# Altium schematic sheet P2_CCD_CAM_BOARD_POWER.SchDoc (part 3 of 3)
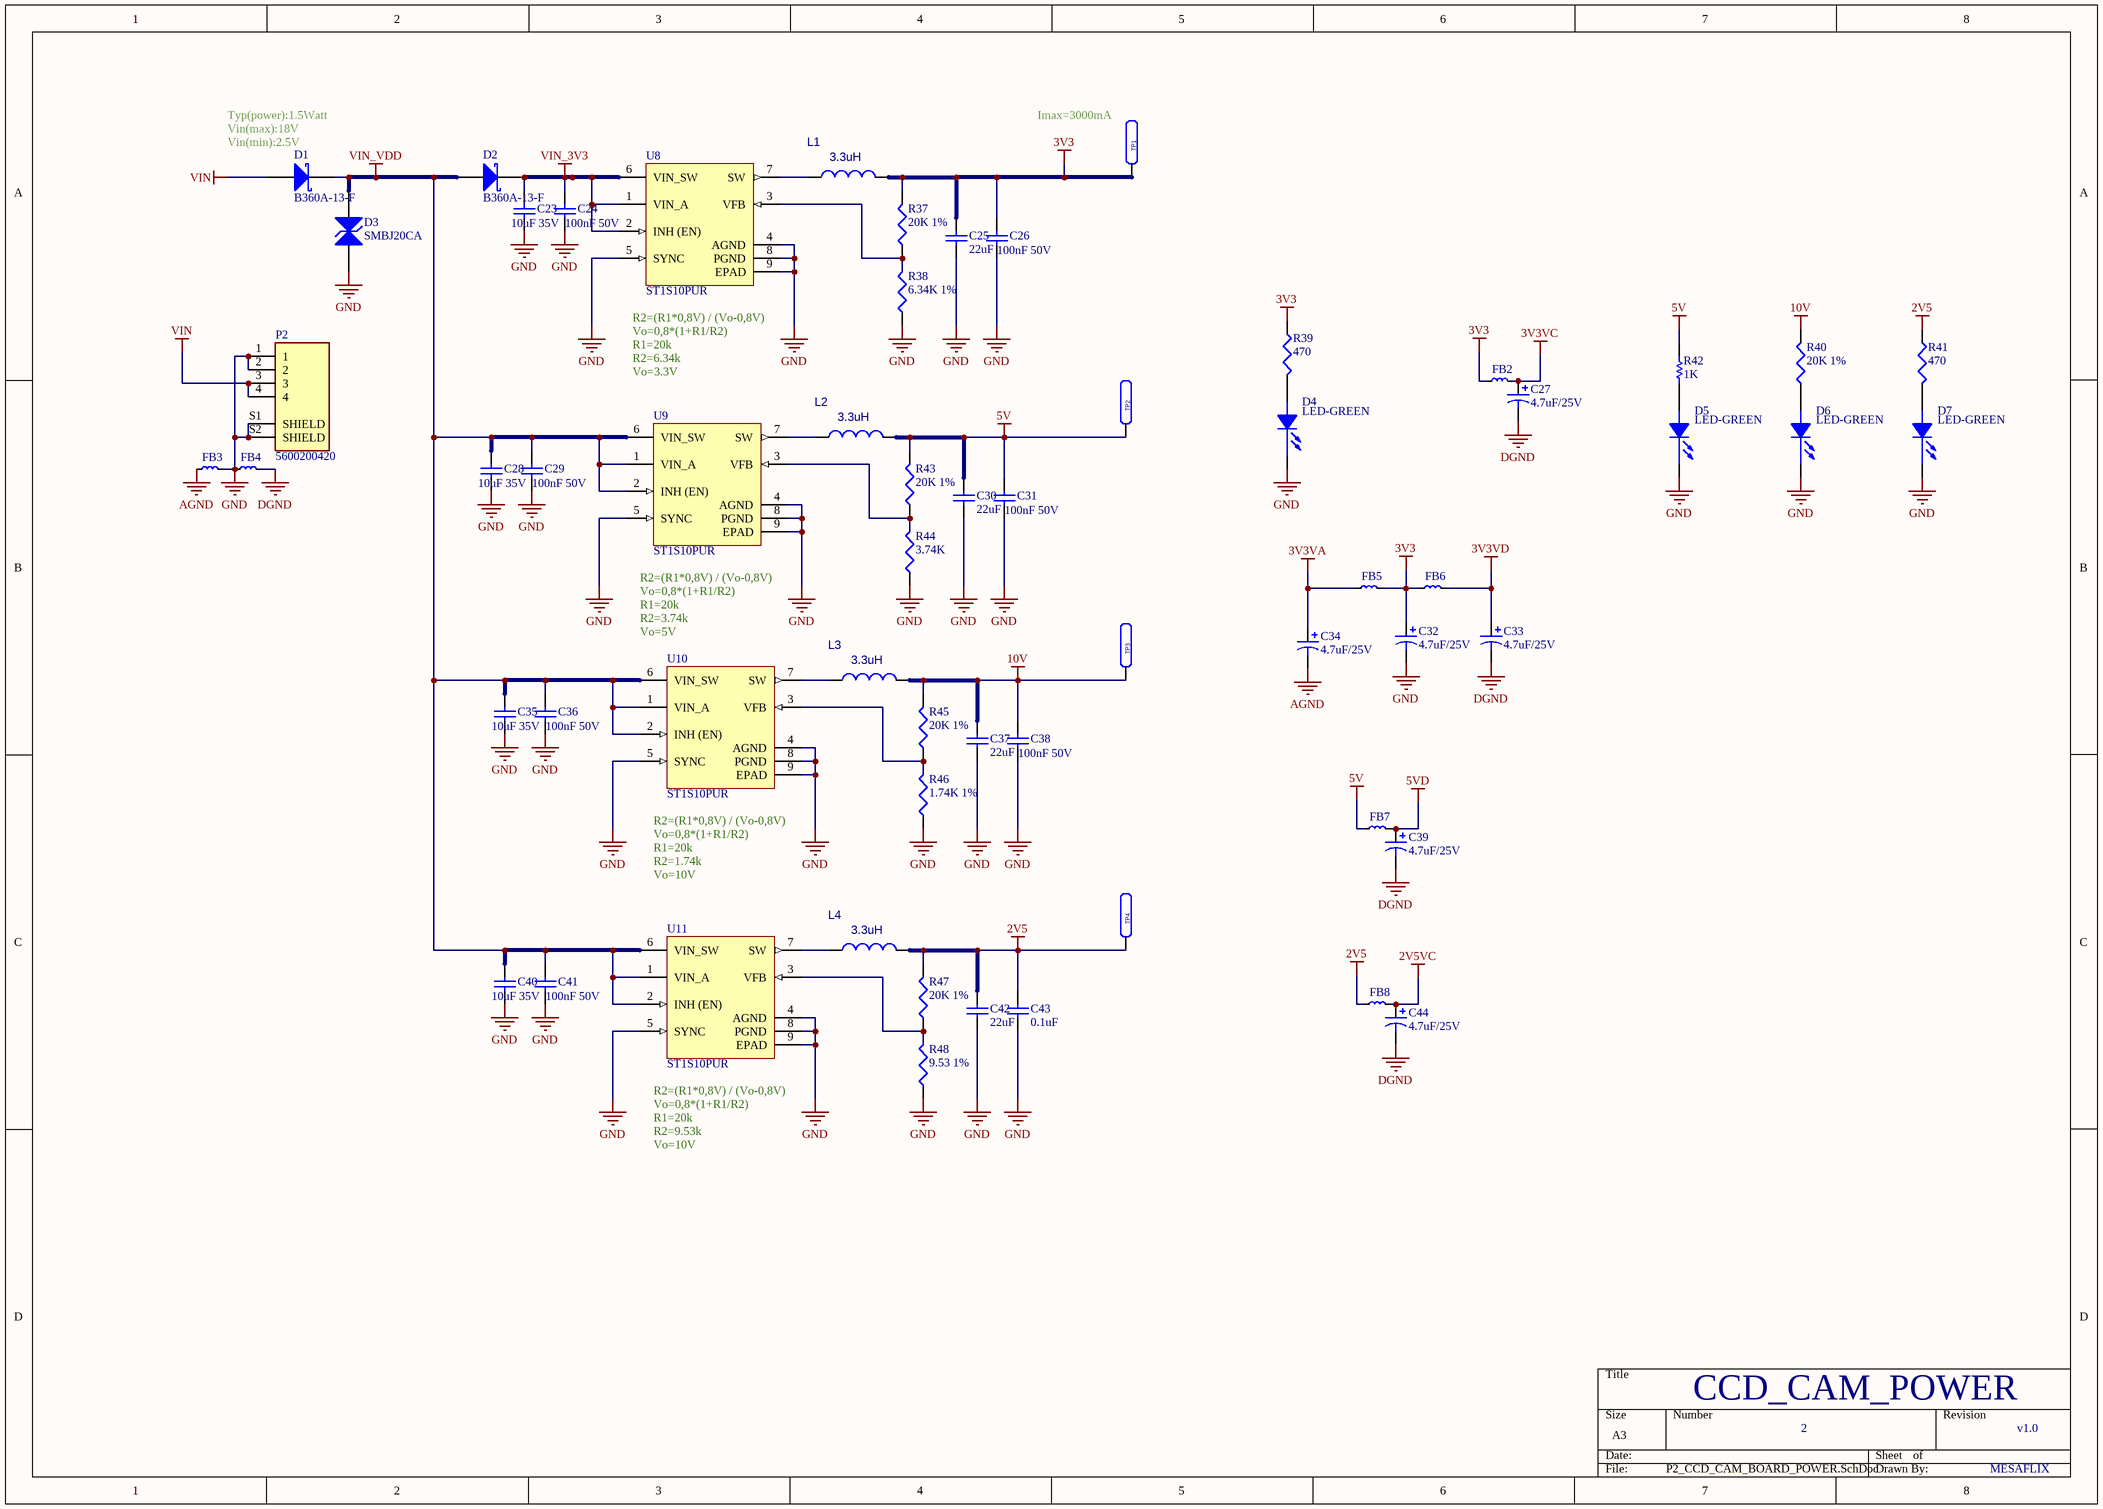
[diagram p2: P2_CCD_CAM_BOARD_POWER.SchDoc]

## Library data of the parts (continued)
R46 = Res3: RES SMD 1.74K OHM 1% 1/16W 0402; MPN: RC0402FR-071K74L; ComponentLink1URL: https://datasheet.ciiva.com/11819/0900766b80c66297-11819477.pdf?src-supplier=RSComponents; ComponentLink1Description: https://datasheet.ciiva.com/11819/0900766b80c66297-11819477.pdf?src-supplier=RSComponents; ComponentLink2URL: https://datasheet.ciiva.com/12666/pyu-rc0402-51-rohs-l-6-r-12666741.pdf?src-supplier=Mouser; ComponentLink2Description: https://datasheet.ciiva.com/12666/pyu-rc0402-51-rohs-l-6-r-12666741.pdf?src-supplier=Mouser; ComponentLink3URL: https://datasheet.ciiva.com/17063/pyu-rc0402-51-rohs-l-6-r-17063193.pdf?src-supplier=Future+Electronics; ComponentLink3Description: https://datasheet.ciiva.com/17063/pyu-rc0402-51-rohs-l-6-r-17063193.pdf?src-supplier=Future+Electronics; ComponentLink4URL: https://datasheet.ciiva.com/22747/1018594-22747513.pdf?src-supplier=Element14; ComponentLink4Description: https://datasheet.ciiva.com/22747/1018594-22747513.pdf?src-supplier=Element14; ComponentLink5URL: https://datasheet.ciiva.com/7849/1018594-7849869.pdf?src-supplier=Element14; ComponentLink5Description: https://datasheet.ciiva.com/7849/1018594-7849869.pdf?src-supplier=Element14; ComponentLink6URL: https://datasheet.ciiva.com/7983/1018594-7983502.pdf?src-supplier=Element14; ComponentLink6Description: https://datasheet.ciiva.com/7983/1018594-7983502.pdf?src-supplier=Element14; ComponentLink7URL: https://datasheet.ciiva.com/7849/1018594-7849871.pdf?src-supplier=Element14; ComponentLink7Description: https://datasheet.ciiva.com/7849/1018594-7849871.pdf?src-supplier=Element14; ComponentLink8URL: https://datasheet.ciiva.com/2553/pyu-r-int-thick-7-2553200.pdf?src-supplier=Digi-Key; ComponentLink8Description: https://datasheet.ciiva.com/2553/pyu-r-int-thick-7-2553200.pdf?src-supplier=Digi-Key; ComponentLink9URL: https://datasheet.ciiva.com/7983/1018594-7983501.pdf?src-supplier=Element14; ComponentLink9Description: https://datasheet.ciiva.com/7983/1018594-7983501.pdf?src-supplier=Element14; ComponentLink10URL: https://datasheet.ciiva.com/2553/pyu-r-int-thick-7-2553201.pdf?src-supplier=Digi-Key; ComponentLink10Description: https://datasheet.ciiva.com/2553/pyu-r-int-thick-7-2553201.pdf?src-supplier=Digi-Key; ComponentLink11URL: https://datasheet.ciiva.com/2553/pyu-r-int-thick-7-2553202.pdf?src-supplier=Digi-Key; ComponentLink11Description: https://datasheet.ciiva.com/2553/pyu-r-int-thick-7-2553202.pdf?src-supplier=Digi-Key; ComponentLink12URL: https://datasheet.ciiva.com/15189/getdatasheetpartid-251817-15189388.pdf?src-supplier=Verical; ComponentLink12Description: https://datasheet.ciiva.com/15189/getdatasheetpartid-251817-15189388.pdf?src-supplier=Verical; ComponentLink13URL: https://datasheet.ciiva.com/11808/0900766b80c66297-11808454.pdf?src-supplier=RSComponents; ComponentLink13Description: https://datasheet.ciiva.com/11808/0900766b80c66297-11808454.pdf?src-supplier=RSComponents; ComponentLink14URL: https://datasheet.ciiva.com/2453/pyu-r-int-thick-7-2453494.pdf?src-supplier=Digi-Key; ComponentLink14Description: https://datasheet.ciiva.com/2453/pyu-r-int-thick-7-2453494.pdf?src-supplier=Digi-Key; ComponentLink15URL: https://datasheet.ciiva.com/2453/pyu-r-int-thick-7-2453495.pdf?src-supplier=Digi-Key; ComponentLink15Description: https://datasheet.ciiva.com/2453/pyu-r-int-thick-7-2453495.pdf?src-supplier=Digi-Key; ComponentLink16URL: https://datasheet.ciiva.com/7983/1018594-7983511.pdf?src-supplier=Element14; ComponentLink16Description: https://datasheet.ciiva.com/7983/1018594-7983511.pdf?src-supplier=Element14; ComponentLink17URL: https://datasheet.ciiva.com/12558/pyu-rc0402-51-rohs-l-6-r-8721-12558796.pdf?src-supplier=Mouser; ComponentLink17Description: https://datasheet.ciiva.com/12558/pyu-rc0402-51-rohs-l-6-r-8721-12558796.pdf?src-supplier=Mouser; ComponentLink18URL: https://datasheet.ciiva.com/2453/pyu-r-int-thick-7-2453493.pdf?src-supplier=Digi-Key; ComponentLink18Description: https://datasheet.ciiva.com/2453/pyu-r-int-thick-7-2453493.pdf?src-supplier=Digi-Key; ComponentLink19URL: https://datasheet.ciiva.com/46394/1018594-46394974.pdf?src-supplier=Element14; ComponentLink19Description: https://datasheet.ciiva.com/46394/1018594-46394974.pdf?src-supplier=Element14; ComponentLink20URL: https://datasheet.ciiva.com/15189/getdatasheetpartid-323692-15189807.pdf?src-supplier=Verical; ComponentLink20Description: https://datasheet.ciiva.com/15189/getdatasheetpartid-323692-15189807.pdf?src-supplier=Verical; ComponentLink21URL: https://datasheet.ciiva.com/2519/pyu-r-int-thick-7-2519204.pdf?src-supplier=Digi-Key; ComponentLink21Description: https://datasheet.ciiva.com/2519/pyu-r-int-thick-7-2519204.pdf?src-supplier=Digi-Key; ComponentLink22URL: https://datasheet.ciiva.com/2519/pyu-r-int-thick-7-2519205.pdf?src-supplier=Digi-Key; ComponentLink22Description: https://datasheet.ciiva.com/2519/pyu-r-int-thick-7-2519205.pdf?src-supplier=Digi-Key; ComponentLink23URL: https://datasheet.ciiva.com/2519/pyu-r-int-thick-7-2519206.pdf?src-supplier=Digi-Key; ComponentLink23Description: https://datasheet.ciiva.com/2519/pyu-r-int-thick-7-2519206.pdf?src-supplier=Digi-Key; ComponentLink24URL: https://datasheet.ciiva.com/5556/rk73h-5556598.pdf?src-supplier=Mouser; ComponentLink24Description: https://datasheet.ciiva.com/5556/rk73h-5556598.pdf?src-supplier=Mouser; ComponentLink25URL: https://datasheet.ciiva.com/16868/pyu-rc0402-51-rohs-l-6-16868119.pdf?src-supplier=Avnet+Europe; ComponentLink25Description: https://datasheet.ciiva.com/16868/pyu-rc0402-51-rohs-l-6-16868119.pdf?src-supplier=Avnet+Europe; ComponentLink26URL: https://datasheet.ciiva.com/8892/pyu-rc0402-51-rohs-l-6-8892634.pdf?src-supplier=Avnet; ComponentLink26Description: https://datasheet.ciiva.com/8892/pyu-rc0402-51-rohs-l-6-8892634.pdf?src-supplier=Avnet; ComponentLink27URL: https://datasheet.ciiva.com/28409/pyu-rc0402-51-rohs-l-6-28409292.pdf?src-supplier=Avnet+Europe; ComponentLink27Description: https://datasheet.ciiva.com/28409/pyu-rc0402-51-rohs-l-6-28409292.pdf?src-supplier=Avnet+Europe; ComponentLink28URL: https://datasheet.ciiva.com/2453/pyu-r-int-thick-7-2453629.pdf?src-supplier=Digi-Key; ComponentLink28Description: https://datasheet.ciiva.com/2453/pyu-r-int-thick-7-2453629.pdf?src-supplier=Digi-Key; ComponentLink29URL: https://datasheet.ciiva.com/2453/pyu-r-int-thick-7-2453630.pdf?src-supplier=Digi-Key; ComponentLink29Description: https://datasheet.ciiva.com/2453/pyu-r-int-thick-7-2453630.pdf?src-supplier=Digi-Key
R48 = Res3: RES SMD 5.53K OHM 1% 1/16W 0402; MPN: RC0603FR-079K53L; ComponentLink1URL: https://datasheet.ciiva.com/11819/0900766b80c66297-11819477.pdf?src-supplier=RSComponents; ComponentLink1Description: https://datasheet.ciiva.com/11819/0900766b80c66297-11819477.pdf?src-supplier=RSComponents; ComponentLink2URL: https://datasheet.ciiva.com/12666/pyu-rc0402-51-rohs-l-6-r-12666741.pdf?src-supplier=Mouser; ComponentLink2Description: https://datasheet.ciiva.com/12666/pyu-rc0402-51-rohs-l-6-r-12666741.pdf?src-supplier=Mouser; ComponentLink3URL: https://datasheet.ciiva.com/17063/pyu-rc0402-51-rohs-l-6-r-17063193.pdf?src-supplier=Future+Electronics; ComponentLink3Description: https://datasheet.ciiva.com/17063/pyu-rc0402-51-rohs-l-6-r-17063193.pdf?src-supplier=Future+Electronics; ComponentLink4URL: https://datasheet.ciiva.com/22747/1018594-22747513.pdf?src-supplier=Element14; ComponentLink4Description: https://datasheet.ciiva.com/22747/1018594-22747513.pdf?src-supplier=Element14; ComponentLink5URL: https://datasheet.ciiva.com/7849/1018594-7849869.pdf?src-supplier=Element14; ComponentLink5Description: https://datasheet.ciiva.com/7849/1018594-7849869.pdf?src-supplier=Element14; ComponentLink6URL: https://datasheet.ciiva.com/7983/1018594-7983502.pdf?src-supplier=Element14; ComponentLink6Description: https://datasheet.ciiva.com/7983/1018594-7983502.pdf?src-supplier=Element14; ComponentLink7URL: https://datasheet.ciiva.com/7849/1018594-7849871.pdf?src-supplier=Element14; ComponentLink7Description: https://datasheet.ciiva.com/7849/1018594-7849871.pdf?src-supplier=Element14; ComponentLink8URL: https://datasheet.ciiva.com/2553/pyu-r-int-thick-7-2553200.pdf?src-supplier=Digi-Key; ComponentLink8Description: https://datasheet.ciiva.com/2553/pyu-r-int-thick-7-2553200.pdf?src-supplier=Digi-Key; ComponentLink9URL: https://datasheet.ciiva.com/7983/1018594-7983501.pdf?src-supplier=Element14; ComponentLink9Description: https://datasheet.ciiva.com/7983/1018594-7983501.pdf?src-supplier=Element14; ComponentLink10URL: https://datasheet.ciiva.com/2553/pyu-r-int-thick-7-2553201.pdf?src-supplier=Digi-Key; ComponentLink10Description: https://datasheet.ciiva.com/2553/pyu-r-int-thick-7-2553201.pdf?src-supplier=Digi-Key; ComponentLink11URL: https://datasheet.ciiva.com/2553/pyu-r-int-thick-7-2553202.pdf?src-supplier=Digi-Key; ComponentLink11Description: https://datasheet.ciiva.com/2553/pyu-r-int-thick-7-2553202.pdf?src-supplier=Digi-Key; ComponentLink12URL: https://datasheet.ciiva.com/15189/getdatasheetpartid-251817-15189388.pdf?src-supplier=Verical; ComponentLink12Description: https://datasheet.ciiva.com/15189/getdatasheetpartid-251817-15189388.pdf?src-supplier=Verical; ComponentLink13URL: https://datasheet.ciiva.com/11808/0900766b80c66297-11808454.pdf?src-supplier=RSComponents; ComponentLink13Description: https://datasheet.ciiva.com/11808/0900766b80c66297-11808454.pdf?src-supplier=RSComponents; ComponentLink14URL: https://datasheet.ciiva.com/2453/pyu-r-int-thick-7-2453494.pdf?src-supplier=Digi-Key; ComponentLink14Description: https://datasheet.ciiva.com/2453/pyu-r-int-thick-7-2453494.pdf?src-supplier=Digi-Key; ComponentLink15URL: https://datasheet.ciiva.com/2453/pyu-r-int-thick-7-2453495.pdf?src-supplier=Digi-Key; ComponentLink15Description: https://datasheet.ciiva.com/2453/pyu-r-int-thick-7-2453495.pdf?src-supplier=Digi-Key; ComponentLink16URL: https://datasheet.ciiva.com/7983/1018594-7983511.pdf?src-supplier=Element14; ComponentLink16Description: https://datasheet.ciiva.com/7983/1018594-7983511.pdf?src-supplier=Element14; ComponentLink17URL: https://datasheet.ciiva.com/12558/pyu-rc0402-51-rohs-l-6-r-8721-12558796.pdf?src-supplier=Mouser; ComponentLink17Description: https://datasheet.ciiva.com/12558/pyu-rc0402-51-rohs-l-6-r-8721-12558796.pdf?src-supplier=Mouser; ComponentLink18URL: https://datasheet.ciiva.com/2453/pyu-r-int-thick-7-2453493.pdf?src-supplier=Digi-Key; ComponentLink18Description: https://datasheet.ciiva.com/2453/pyu-r-int-thick-7-2453493.pdf?src-supplier=Digi-Key; ComponentLink19URL: https://datasheet.ciiva.com/46394/1018594-46394974.pdf?src-supplier=Element14; ComponentLink19Description: https://datasheet.ciiva.com/46394/1018594-46394974.pdf?src-supplier=Element14; ComponentLink20URL: https://datasheet.ciiva.com/15189/getdatasheetpartid-323692-15189807.pdf?src-supplier=Verical; ComponentLink20Description: https://datasheet.ciiva.com/15189/getdatasheetpartid-323692-15189807.pdf?src-supplier=Verical; ComponentLink21URL: https://datasheet.ciiva.com/2519/pyu-r-int-thick-7-2519204.pdf?src-supplier=Digi-Key; ComponentLink21Description: https://datasheet.ciiva.com/2519/pyu-r-int-thick-7-2519204.pdf?src-supplier=Digi-Key; ComponentLink22URL: https://datasheet.ciiva.com/2519/pyu-r-int-thick-7-2519205.pdf?src-supplier=Digi-Key; ComponentLink22Description: https://datasheet.ciiva.com/2519/pyu-r-int-thick-7-2519205.pdf?src-supplier=Digi-Key; ComponentLink23URL: https://datasheet.ciiva.com/2519/pyu-r-int-thick-7-2519206.pdf?src-supplier=Digi-Key; ComponentLink23Description: https://datasheet.ciiva.com/2519/pyu-r-int-thick-7-2519206.pdf?src-supplier=Digi-Key; ComponentLink24URL: https://datasheet.ciiva.com/5556/rk73h-5556598.pdf?src-supplier=Mouser; ComponentLink24Description: https://datasheet.ciiva.com/5556/rk73h-5556598.pdf?src-supplier=Mouser; ComponentLink25URL: https://datasheet.ciiva.com/16868/pyu-rc0402-51-rohs-l-6-16868119.pdf?src-supplier=Avnet+Europe; ComponentLink25Description: https://datasheet.ciiva.com/16868/pyu-rc0402-51-rohs-l-6-16868119.pdf?src-supplier=Avnet+Europe; ComponentLink26URL: https://datasheet.ciiva.com/8892/pyu-rc0402-51-rohs-l-6-8892634.pdf?src-supplier=Avnet; ComponentLink26Description: https://datasheet.ciiva.com/8892/pyu-rc0402-51-rohs-l-6-8892634.pdf?src-supplier=Avnet; ComponentLink27URL: https://datasheet.ciiva.com/28409/pyu-rc0402-51-rohs-l-6-28409292.pdf?src-supplier=Avnet+Europe; ComponentLink27Description: https://datasheet.ciiva.com/28409/pyu-rc0402-51-rohs-l-6-28409292.pdf?src-supplier=Avnet+Europe; ComponentLink28URL: https://datasheet.ciiva.com/2453/pyu-r-int-thick-7-2453629.pdf?src-supplier=Digi-Key; ComponentLink28Description: https://datasheet.ciiva.com/2453/pyu-r-int-thick-7-2453629.pdf?src-supplier=Digi-Key; ComponentLink29URL: https://datasheet.ciiva.com/2453/pyu-r-int-thick-7-2453630.pdf?src-supplier=Digi-Key; ComponentLink29Description: https://datasheet.ciiva.com/2453/pyu-r-int-thick-7-2453630.pdf?src-supplier=Digi-Key
TP1-TP4 = LABTESTPOINT: OriginalSymbolOrigin: (0,50); PATH: I62; PACK_TYPE: PIN; SEC: 1; XY: (-650,5200); VER: 3; ROT: 0; LOCATION: TP501; DRAWING: @P3326_A01_LIB.P3326_A01(SCH_1):PAGE3; DEVICE_TYPENAME: LABTESTPOINT_PIN-LABTESTPOINT; CDS_LIB: electro_mechanic; SKU: COMMON; PHYS_PAGE: 3; CHIPS_PART_NAME: LABTESTPOINT; CDS_SEC: 1; CDS_PHYS_PART_NAME: LABTESTPOINT_PIN-LABTESTPOINT; CDS_PART_NAME: LABTESTPOINT_PIN-LABTESTPOINT; CDS_LOCATION: TP501
U8-U11 = CMP-0240-00156-1: Monolithic synchronous step-down regulator, 8-Pin DFN, Tape and Reel; Manufacturer: STMicroelectronics; Output Current: 3A; Switching Frequency: 1.2MHz; Operating Supply Voltage: 18V; Number of Outputs: 1; Output Voltage: 15.3V; Min Input Voltage: 2.5V; Efficiency: 90%; Quiescent Current: 2.5mA; Output Type: Adjustable; Synchronous Rectifier: Yes; Min Output Voltage: 800mV; ComponentLink1URL: http://www.st.com; ComponentLink2Description: Datasheet; ComponentLink1Description: Manufacturer URL; ComponentLink2URL: http://www.st.com/internet/com/TECHNICAL_RESOURCES/TECHNICAL_LITERATURE/DATASHEET/CD00169322.pdf; Supplier 1: Digi-Key; Supplier Part Number 1: 497-6313-1-ND; Manufacturer Part Number: ST1S10PUR; RoHS: Yes; Category: Voltage Regulators - Switching; Stock 1: 402; Pricing 1: 1=1,73000, 10=1,55600, 25=1,46760, 100=1,17400, 250=1,02724, 500=0,99790, 1000=0,79245 (USD); Mount: Surface Mount; Case/Package: DFN; Number of Pins: 8; Weight: 0.001319oz; Min Operating Temperature: -25°C; Max Operating Temperature: 125°C; Package Quantity: 4500; Packaging: Tape and Reel; Max Input Voltage: 18V; Max Duty Cycle: 90%; Max Output Current: 3A; Max Output Voltage: 15.3V; Length: 4mm; Height: 0.9mm; Width: 4mm; Radiation Hardening: No; Lead Free: Lead Free; REACH SVHC: No SVHC; ComponentLink3URL: https://datasheet.ciiva.com/15113/getdatasheetpartid-188392-15113798.pdf?src-supplier=Verical; ComponentLink3Description: https://datasheet.ciiva.com/15113/getdatasheetpartid-188392-15113798.pdf?src-supplier=Verical; ComponentLink4URL: https://datasheet.ciiva.com/26902/st1s10pur-26902772.pdf?src-supplier=IIIC; ComponentLink4Description: https://datasheet.ciiva.com/26902/st1s10pur-26902772.pdf?src-supplier=IIIC; ComponentLink5URL: https://datasheet.ciiva.com/2025/cd00169322-2025410.pdf?src-supplier=Digi-Key; ComponentLink5Description: https://datasheet.ciiva.com/2025/cd00169322-2025410.pdf?src-supplier=Digi-Key; ComponentLink6URL: https://datasheet.ciiva.com/2025/cd00169322-2025408.pdf?src-supplier=Digi-Key; ComponentLink6Description: https://datasheet.ciiva.com/2025/cd00169322-2025408.pdf?src-supplier=Digi-Key; ComponentLink7URL: https://datasheet.ciiva.com/2025/cd00169322-2025409.pdf?src-supplier=Digi-Key; ComponentLink7Description: https://datasheet.ciiva.com/2025/cd00169322-2025409.pdf?src-supplier=Digi-Key; ComponentLink8URL: https://datasheet.ciiva.com/16205/cd00169322-16205241.pdf?src-supplier=Future+Electronics; ComponentLink8Description: https://datasheet.ciiva.com/16205/cd00169322-16205241.pdf?src-supplier=Future+Electronics; ComponentLink9URL: https://datasheet.ciiva.com/4905/cd00169322-4905020.pdf?src-supplier=Mouser; ComponentLink9Description: https://datasheet.ciiva.com/4905/cd00169322-4905020.pdf?src-supplier=Mouser; ComponentLink10URL: https://datasheet.ciiva.com/41457/001185576-da-01-en-ic-reg-buck-sync-a-st1s10pur-3adfn-8-stm-41457644.pdf?src-supplier=Conrad; ComponentLink10Description: https://datasheet.ciiva.com/41457/001185576-da-01-en-ic-reg-buck-sync-a-st1s10pur-3adfn-8-stm-41457644.pdf?src-supplier=Conrad